# Altium schematic sheet NB2_DBCON.SchDoc: 3-Way Daughter-Board Socket
size A3; Organization: Altium Limited.; Address1: Level 3, 12a Rodborough Rd; Address2: Frenchs Forest 2086; Address3: NSW; Address4: AUSTRALIA; SheetNumber: 1; SheetTotal: 100; PageSetup: Record=PageOptions|CenterHorizontal=True|CenterVertical=True|PrintScale=0.75|XCorrection=1.00|YCorrection=1.00|PrintKind=0|BorderSize=5000000|LeftOffset=0|BottomOffset=0|Orientation=2|PaperLength=1000|PaperWidth=1000|Scale=100|PaperSource=7|PrintQuality=600|MediaType=1|DitherType=10|PaperKind=A4 (210 x 297mm)|PrintScaleMode=1
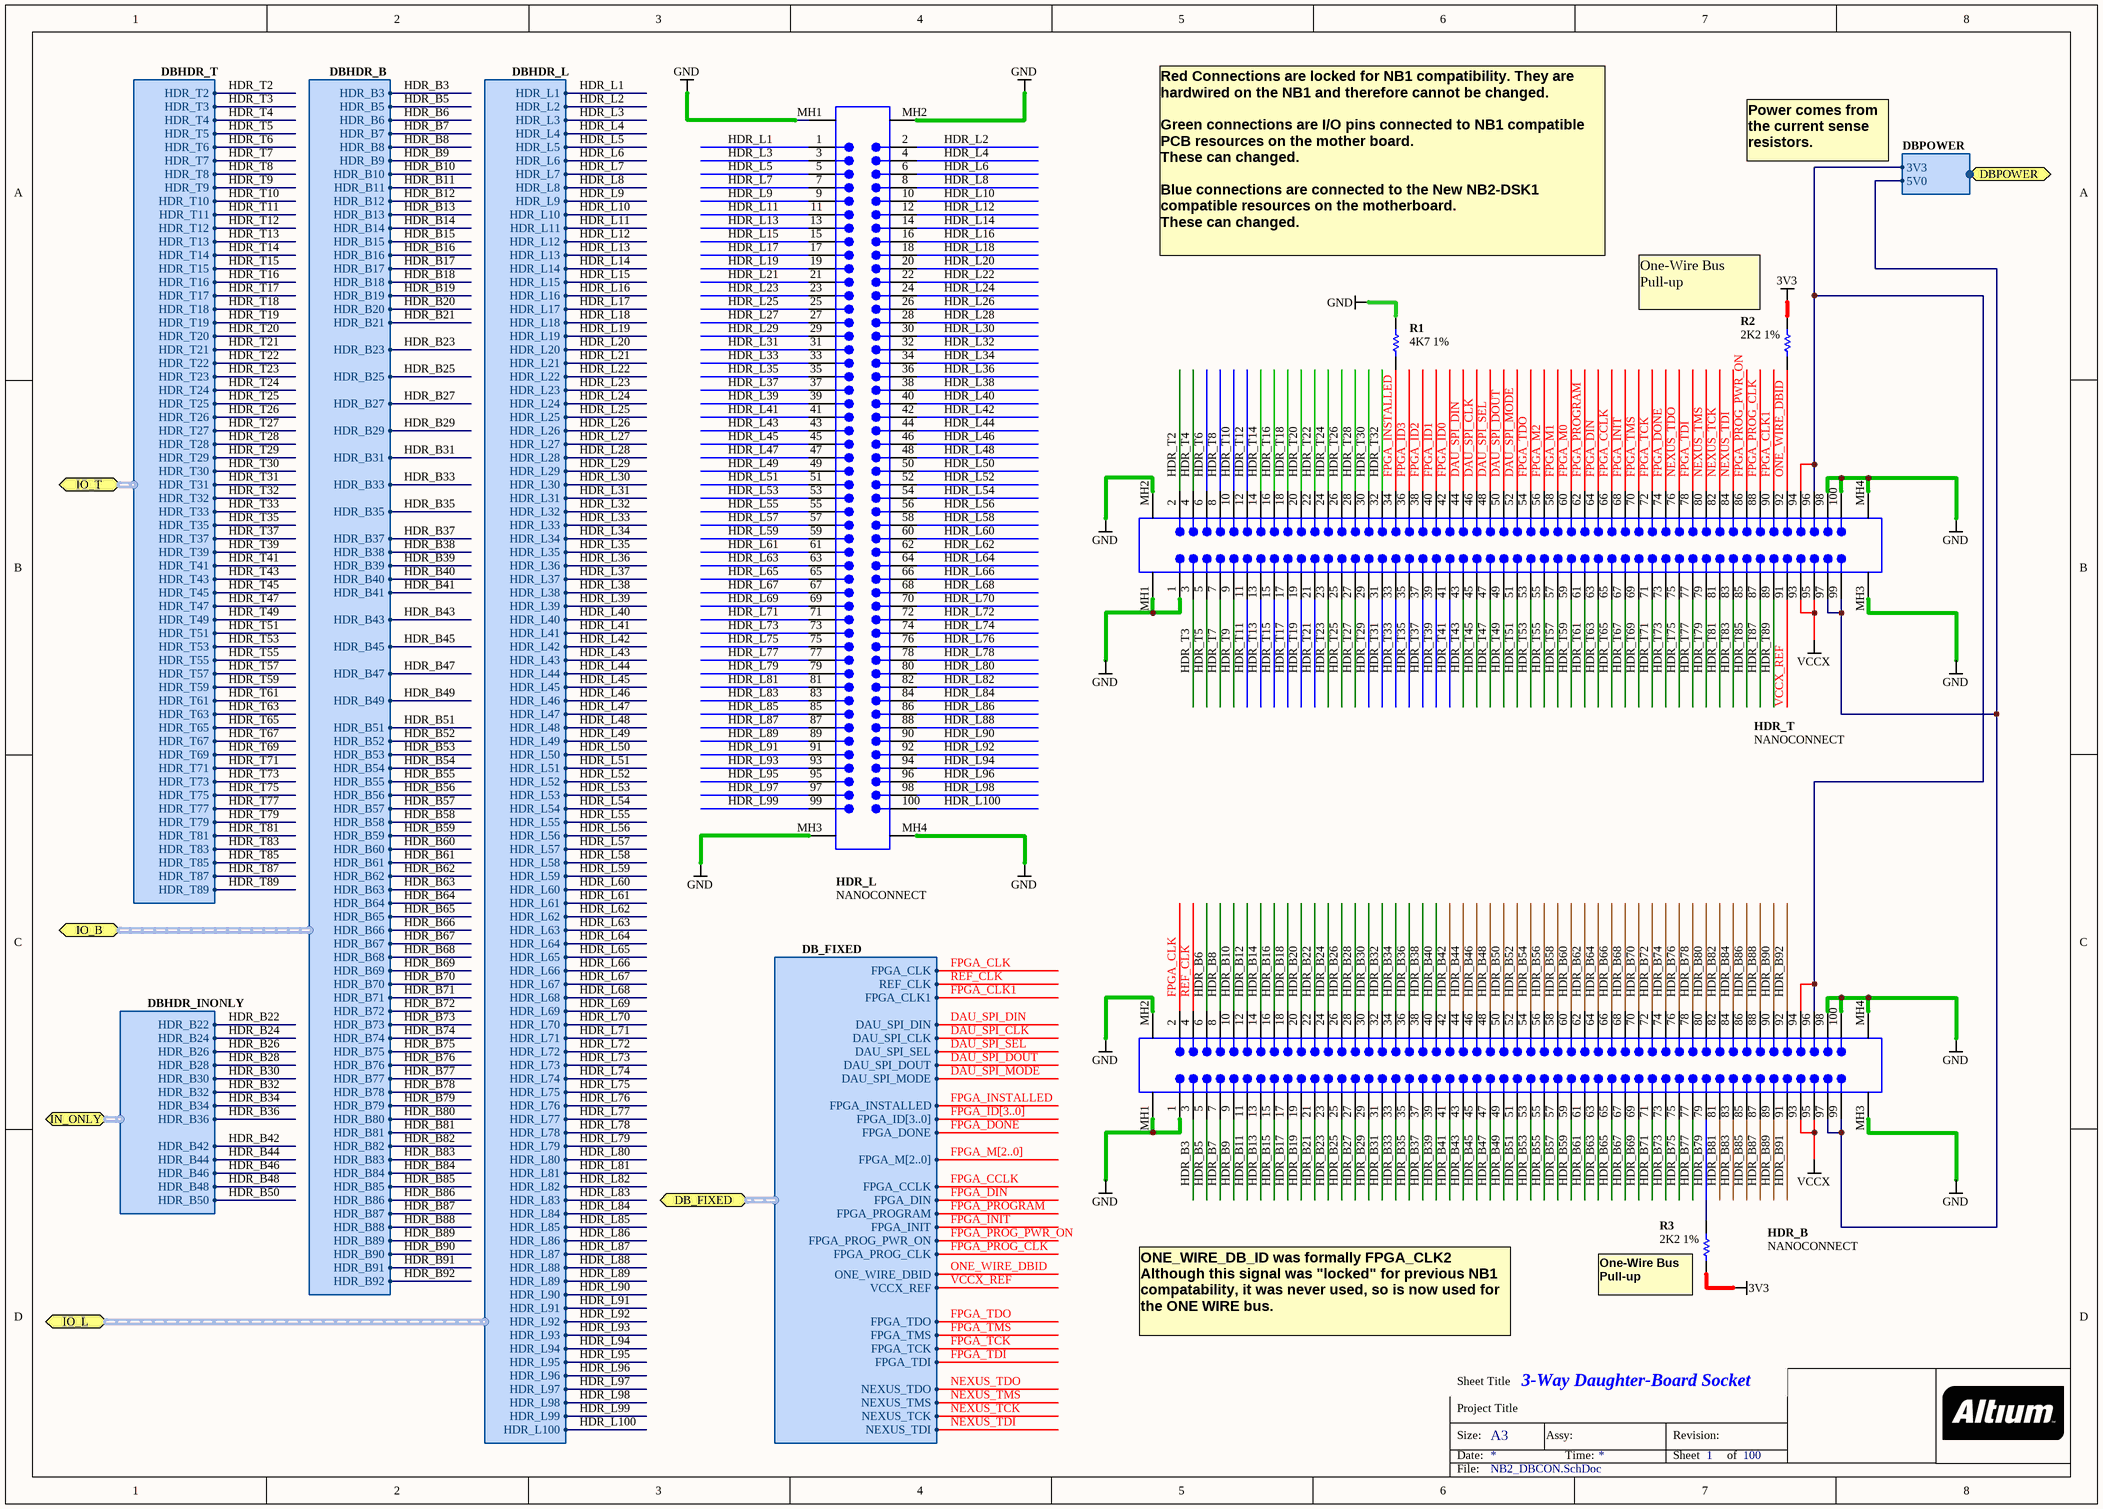
[diagram p0: NB2_DBCON.SchDoc]

## Parts
HDR_B  NANOCONNECT  [53751]
HDR_L  NANOCONNECT  [53751]
HDR_T  NANOCONNECT  [53751]
R1  4K7 1%  [RESC1005-STAR]
R2  2K2 1%  [RESC1005-STAR]
R3  2K2 1%  [RESC1005-STAR]

## Ports
DB_FIXED (harness DB_FIXED), DBPOWER (harness DBPOWER), IN_ONLY (harness DBHDR_INONLY), IO_B (harness DBHDR_B), IO_L (harness DBHDR_L), IO_T (harness DBHDR_T)

## Harnesses
DBPOWER: 3V3, 5V0
DB_FIXED: DAU_SPI_CLK, DAU_SPI_DIN, DAU_SPI_DOUT, NEXUS_TMS, NEXUS_TDI, NEXUS_TDO, NEXUS_TCK, ONE_WIRE_DBID, FPGA_INSTALLED, FPGA_PROG_CLK, DAU_SPI_SEL, DAU_SPI_MODE, FPGA_PROG_PWR_ON, FPGA_DONE, FPGA_CCLK, FPGA_PROGRAM, FPGA_DIN, FPGA_INIT, FPGA_TDO, FPGA_TDI, FPGA_TCK, FPGA_TMS, FPGA_CLK1, FPGA_ID[3..0], FPGA_M[2..0], VCCX_REF, FPGA_CLK, REF_CLK
DBHDR_B: HDR_B3, HDR_B5, HDR_B6, HDR_B7, HDR_B8, HDR_B9, HDR_B10, HDR_B11, HDR_B12, HDR_B13, HDR_B14, HDR_B15, HDR_B16, HDR_B17, HDR_B18, HDR_B19, HDR_B20, HDR_B21, HDR_B23, HDR_B25, HDR_B27, HDR_B29, HDR_B31, HDR_B33, HDR_B35, HDR_B37, HDR_B38, HDR_B39, HDR_B40, HDR_B41, HDR_B43, HDR_B45, HDR_B47, HDR_B49, HDR_B51, HDR_B52, HDR_B53, HDR_B54, HDR_B55, HDR_B56, HDR_B57, HDR_B58, HDR_B59, HDR_B60, HDR_B61, HDR_B62, HDR_B63, HDR_B64, HDR_B65, HDR_B66, HDR_B67, HDR_B68, HDR_B69, HDR_B70, HDR_B71, HDR_B72, HDR_B73, HDR_B74, HDR_B75, HDR_B76, HDR_B77, HDR_B78, HDR_B79, HDR_B80, HDR_B81, HDR_B82, HDR_B83, HDR_B84, HDR_B85, HDR_B86, HDR_B87, HDR_B88, HDR_B89, HDR_B90, HDR_B91, HDR_B92
DBHDR_T: HDR_T2, HDR_T3, HDR_T4, HDR_T5, HDR_T6, HDR_T7, HDR_T8, HDR_T9, HDR_T10, HDR_T11, HDR_T12, HDR_T13, HDR_T14, HDR_T15, HDR_T16, HDR_T17, HDR_T18, HDR_T19, HDR_T20, HDR_T21, HDR_T22, HDR_T23, HDR_T24, HDR_T25, HDR_T26, HDR_T27, HDR_T28, HDR_T29, HDR_T30, HDR_T31, HDR_T32, HDR_T33, HDR_T35, HDR_T37, HDR_T39, HDR_T41, HDR_T43, HDR_T45, HDR_T47, HDR_T49, HDR_T51, HDR_T53, HDR_T55, HDR_T57, HDR_T59, HDR_T61, HDR_T63, HDR_T65, HDR_T67, HDR_T69, HDR_T71, HDR_T73, HDR_T75, HDR_T77, HDR_T79, HDR_T81, HDR_T83, HDR_T85, HDR_T87, HDR_T89
DBHDR_L: HDR_L1, HDR_L2, HDR_L3, HDR_L4, HDR_L5, HDR_L6, HDR_L7, HDR_L8, HDR_L9, HDR_L10, HDR_L11, HDR_L12, HDR_L13, HDR_L14, HDR_L15, HDR_L16, HDR_L17, HDR_L18, HDR_L19, HDR_L20, HDR_L21, HDR_L22, HDR_L23, HDR_L24, HDR_L25, HDR_L26, HDR_L27, HDR_L28, HDR_L29, HDR_L30, HDR_L31, HDR_L32, HDR_L33, HDR_L34, HDR_L35, HDR_L36, HDR_L37, HDR_L38, HDR_L39, HDR_L40, HDR_L41, HDR_L42, HDR_L43, HDR_L44, HDR_L45, HDR_L46, HDR_L47, HDR_L48, HDR_L49, HDR_L50, HDR_L51, HDR_L52, HDR_L53, HDR_L54, HDR_L55, HDR_L56, HDR_L57, HDR_L58, HDR_L59, HDR_L60, HDR_L61, HDR_L62, HDR_L63, HDR_L64, HDR_L65, HDR_L66, HDR_L67, HDR_L68, HDR_L69, HDR_L70, HDR_L71, HDR_L72, HDR_L73, HDR_L74, HDR_L75, HDR_L76, HDR_L77, HDR_L78, HDR_L79, HDR_L80, HDR_L81, HDR_L82, HDR_L83, HDR_L84, HDR_L85, HDR_L86, HDR_L87, HDR_L88, HDR_L89, HDR_L90, HDR_L91, HDR_L92, HDR_L93, HDR_L94, HDR_L95, HDR_L96, HDR_L97, HDR_L98, HDR_L99, HDR_L100
DBHDR_INONLY: HDR_B22, HDR_B24, HDR_B26, HDR_B28, HDR_B30, HDR_B32, HDR_B34, HDR_B36, HDR_B42, HDR_B44, HDR_B46, HDR_B48, HDR_B50

## Nets
3V3: R2.2 R3.1
GND: HDR_B.1 HDR_B.98 HDR_B.100 HDR_B.MH1 HDR_B.MH2 HDR_B.MH3 HDR_B.MH4 HDR_L.MH1 HDR_L.MH2 HDR_L.MH3 HDR_L.MH4 HDR_T.1 HDR_T.98 HDR_T.100 HDR_T.MH1 HDR_T.MH2 HDR_T.MH3 HDR_T.MH4 R1.2
VCCX: HDR_B.93 HDR_B.95 HDR_T.93 HDR_T.95
DAU_SPI_CLK: HDR_T.46 ; port DB_FIXED.DAU_SPI_CLK
DAU_SPI_DIN: HDR_T.44 ; port DB_FIXED.DAU_SPI_DIN
DAU_SPI_DOUT: HDR_T.50 ; port DB_FIXED.DAU_SPI_DOUT
DAU_SPI_MODE: HDR_T.52 ; port DB_FIXED.DAU_SPI_MODE
DAU_SPI_SEL: HDR_T.48 ; port DB_FIXED.DAU_SPI_SEL
FPGA_CCLK: HDR_T.66 ; port DB_FIXED.FPGA_CCLK
FPGA_CLK: HDR_B.2 ; port DB_FIXED.FPGA_CLK
FPGA_CLK1: HDR_T.90 ; port DB_FIXED.FPGA_CLK1
FPGA_DIN: HDR_T.64 ; port DB_FIXED.FPGA_DIN
FPGA_DONE: HDR_T.74 ; port DB_FIXED.FPGA_DONE
FPGA_ID0: HDR_T.42
FPGA_ID1: HDR_T.40
FPGA_ID2: HDR_T.38
FPGA_ID3: HDR_T.36
FPGA_INIT: HDR_T.68 ; port DB_FIXED.FPGA_INIT
FPGA_INSTALLED: HDR_T.34 R1.1 ; port DB_FIXED.FPGA_INSTALLED
FPGA_M0: HDR_T.60
FPGA_M1: HDR_T.58
FPGA_M2: HDR_T.56
FPGA_PROG_CLK: HDR_T.88 ; port DB_FIXED.FPGA_PROG_CLK
FPGA_PROG_PWR_ON: HDR_T.86 ; port DB_FIXED.FPGA_PROG_PWR_ON
FPGA_PROGRAM: HDR_T.62 ; port DB_FIXED.FPGA_PROGRAM
FPGA_TCK: HDR_T.72 ; port DB_FIXED.FPGA_TCK
FPGA_TDI: HDR_T.78 ; port DB_FIXED.FPGA_TDI
FPGA_TDO: HDR_T.54 ; port DB_FIXED.FPGA_TDO
FPGA_TMS: HDR_T.70 ; port DB_FIXED.FPGA_TMS
HDR_B3: HDR_B.3 ; port IO_B.HDR_B3
HDR_B5: HDR_B.5 ; port IO_B.HDR_B5
HDR_B6: HDR_B.6 ; port IO_B.HDR_B6
HDR_B7: HDR_B.7 ; port IO_B.HDR_B7
HDR_B8: HDR_B.8 ; port IO_B.HDR_B8
HDR_B9: HDR_B.9 ; port IO_B.HDR_B9
HDR_B10: HDR_B.10 ; port IO_B.HDR_B10
HDR_B11: HDR_B.11 ; port IO_B.HDR_B11
HDR_B12: HDR_B.12 ; port IO_B.HDR_B12
HDR_B13: HDR_B.13 ; port IO_B.HDR_B13
HDR_B14: HDR_B.14 ; port IO_B.HDR_B14
HDR_B15: HDR_B.15 ; port IO_B.HDR_B15
HDR_B16: HDR_B.16 ; port IO_B.HDR_B16
HDR_B17: HDR_B.17 ; port IO_B.HDR_B17
HDR_B18: HDR_B.18 ; port IO_B.HDR_B18
HDR_B19: HDR_B.19 ; port IO_B.HDR_B19
HDR_B20: HDR_B.20 ; port IO_B.HDR_B20
HDR_B21: HDR_B.21 ; port IO_B.HDR_B21
HDR_B22: HDR_B.22 ; port IN_ONLY.HDR_B22
HDR_B23: HDR_B.23 ; port IO_B.HDR_B23
HDR_B24: HDR_B.24 ; port IN_ONLY.HDR_B24
HDR_B25: HDR_B.25 ; port IO_B.HDR_B25
HDR_B26: HDR_B.26 ; port IN_ONLY.HDR_B26
HDR_B27: HDR_B.27 ; port IO_B.HDR_B27
HDR_B28: HDR_B.28 ; port IN_ONLY.HDR_B28
HDR_B29: HDR_B.29 ; port IO_B.HDR_B29
HDR_B30: HDR_B.30 ; port IN_ONLY.HDR_B30
HDR_B31: HDR_B.31 ; port IO_B.HDR_B31
HDR_B32: HDR_B.32 ; port IN_ONLY.HDR_B32
HDR_B33: HDR_B.33 ; port IO_B.HDR_B33
HDR_B34: HDR_B.34 ; port IN_ONLY.HDR_B34
HDR_B35: HDR_B.35 ; port IO_B.HDR_B35
HDR_B36: HDR_B.36 ; port IN_ONLY.HDR_B36
HDR_B37: HDR_B.37 ; port IO_B.HDR_B37
HDR_B38: HDR_B.38 ; port IO_B.HDR_B38
HDR_B39: HDR_B.39 ; port IO_B.HDR_B39
HDR_B40: HDR_B.40 ; port IO_B.HDR_B40
HDR_B41: HDR_B.41 ; port IO_B.HDR_B41
HDR_B42: HDR_B.42 ; port IN_ONLY.HDR_B42
HDR_B43: HDR_B.43 ; port IO_B.HDR_B43
HDR_B44: HDR_B.44 ; port IN_ONLY.HDR_B44
HDR_B45: HDR_B.45 ; port IO_B.HDR_B45
HDR_B46: HDR_B.46 ; port IN_ONLY.HDR_B46
HDR_B47: HDR_B.47 ; port IO_B.HDR_B47
HDR_B48: HDR_B.48 ; port IN_ONLY.HDR_B48
HDR_B49: HDR_B.49 ; port IO_B.HDR_B49
HDR_B50: HDR_B.50 ; port IN_ONLY.HDR_B50
HDR_B51: HDR_B.51 ; port IO_B.HDR_B51
HDR_B52: HDR_B.52 ; port IO_B.HDR_B52
HDR_B53: HDR_B.53 ; port IO_B.HDR_B53
HDR_B54: HDR_B.54 ; port IO_B.HDR_B54
HDR_B55: HDR_B.55 ; port IO_B.HDR_B55
HDR_B56: HDR_B.56 ; port IO_B.HDR_B56
HDR_B57: HDR_B.57 ; port IO_B.HDR_B57
HDR_B58: HDR_B.58 ; port IO_B.HDR_B58
HDR_B59: HDR_B.59 ; port IO_B.HDR_B59
HDR_B60: HDR_B.60 ; port IO_B.HDR_B60
HDR_B61: HDR_B.61 ; port IO_B.HDR_B61
HDR_B62: HDR_B.62 ; port IO_B.HDR_B62
HDR_B63: HDR_B.63 ; port IO_B.HDR_B63
HDR_B64: HDR_B.64 ; port IO_B.HDR_B64
HDR_B65: HDR_B.65 ; port IO_B.HDR_B65
HDR_B66: HDR_B.66 ; port IO_B.HDR_B66
HDR_B67: HDR_B.67 ; port IO_B.HDR_B67
HDR_B68: HDR_B.68 ; port IO_B.HDR_B68
HDR_B69: HDR_B.69 ; port IO_B.HDR_B69
HDR_B70: HDR_B.70 ; port IO_B.HDR_B70
HDR_B71: HDR_B.71 ; port IO_B.HDR_B71
HDR_B72: HDR_B.72 ; port IO_B.HDR_B72
HDR_B73: HDR_B.73 ; port IO_B.HDR_B73
HDR_B74: HDR_B.74 ; port IO_B.HDR_B74
HDR_B75: HDR_B.75 ; port IO_B.HDR_B75
HDR_B76: HDR_B.76 ; port IO_B.HDR_B76
HDR_B77: HDR_B.77 ; port IO_B.HDR_B77
HDR_B78: HDR_B.78 ; port IO_B.HDR_B78
HDR_B79: HDR_B.79 R3.2 ; port IO_B.HDR_B79
HDR_B80: HDR_B.80 ; port IO_B.HDR_B80
HDR_B81: HDR_B.81 ; port IO_B.HDR_B81
HDR_B82: HDR_B.82 ; port IO_B.HDR_B82
HDR_B83: HDR_B.83 ; port IO_B.HDR_B83
HDR_B84: HDR_B.84 ; port IO_B.HDR_B84
HDR_B85: HDR_B.85 ; port IO_B.HDR_B85
HDR_B86: HDR_B.86 ; port IO_B.HDR_B86
HDR_B87: HDR_B.87 ; port IO_B.HDR_B87
HDR_B88: HDR_B.88 ; port IO_B.HDR_B88
HDR_B89: HDR_B.89 ; port IO_B.HDR_B89
HDR_B90: HDR_B.90 ; port IO_B.HDR_B90
HDR_B91: HDR_B.91 ; port IO_B.HDR_B91
HDR_B92: HDR_B.92 ; port IO_B.HDR_B92
HDR_L1: HDR_L.1 ; port IO_L.HDR_L1
HDR_L2: HDR_L.2 ; port IO_L.HDR_L2
HDR_L3: HDR_L.3 ; port IO_L.HDR_L3
HDR_L4: HDR_L.4 ; port IO_L.HDR_L4
HDR_L5: HDR_L.5 ; port IO_L.HDR_L5
HDR_L6: HDR_L.6 ; port IO_L.HDR_L6
HDR_L7: HDR_L.7 ; port IO_L.HDR_L7
HDR_L8: HDR_L.8 ; port IO_L.HDR_L8
HDR_L9: HDR_L.9 ; port IO_L.HDR_L9
HDR_L10: HDR_L.10 ; port IO_L.HDR_L10
HDR_L11: HDR_L.11 ; port IO_L.HDR_L11
HDR_L12: HDR_L.12 ; port IO_L.HDR_L12
HDR_L13: HDR_L.13 ; port IO_L.HDR_L13
HDR_L14: HDR_L.14 ; port IO_L.HDR_L14
HDR_L15: HDR_L.15 ; port IO_L.HDR_L15
HDR_L16: HDR_L.16 ; port IO_L.HDR_L16
HDR_L17: HDR_L.17 ; port IO_L.HDR_L17
HDR_L18: HDR_L.18 ; port IO_L.HDR_L18
HDR_L19: HDR_L.19 ; port IO_L.HDR_L19
HDR_L20: HDR_L.20 ; port IO_L.HDR_L20
HDR_L21: HDR_L.21 ; port IO_L.HDR_L21
HDR_L22: HDR_L.22 ; port IO_L.HDR_L22
HDR_L23: HDR_L.23 ; port IO_L.HDR_L23
HDR_L24: HDR_L.24 ; port IO_L.HDR_L24
HDR_L25: HDR_L.25 ; port IO_L.HDR_L25
HDR_L26: HDR_L.26 ; port IO_L.HDR_L26
HDR_L27: HDR_L.27 ; port IO_L.HDR_L27
HDR_L28: HDR_L.28 ; port IO_L.HDR_L28
HDR_L29: HDR_L.29 ; port IO_L.HDR_L29
HDR_L30: HDR_L.30 ; port IO_L.HDR_L30
HDR_L31: HDR_L.31 ; port IO_L.HDR_L31
HDR_L32: HDR_L.32 ; port IO_L.HDR_L32
HDR_L33: HDR_L.33 ; port IO_L.HDR_L33
HDR_L34: HDR_L.34 ; port IO_L.HDR_L34
HDR_L35: HDR_L.35 ; port IO_L.HDR_L35
HDR_L36: HDR_L.36 ; port IO_L.HDR_L36
HDR_L37: HDR_L.37 ; port IO_L.HDR_L37
HDR_L38: HDR_L.38 ; port IO_L.HDR_L38
HDR_L39: HDR_L.39 ; port IO_L.HDR_L39
HDR_L40: HDR_L.40 ; port IO_L.HDR_L40
HDR_L41: HDR_L.41 ; port IO_L.HDR_L41
HDR_L42: HDR_L.42 ; port IO_L.HDR_L42
HDR_L43: HDR_L.43 ; port IO_L.HDR_L43
HDR_L44: HDR_L.44 ; port IO_L.HDR_L44
HDR_L45: HDR_L.45 ; port IO_L.HDR_L45
HDR_L46: HDR_L.46 ; port IO_L.HDR_L46
HDR_L47: HDR_L.47 ; port IO_L.HDR_L47
HDR_L48: HDR_L.48 ; port IO_L.HDR_L48
HDR_L49: HDR_L.49 ; port IO_L.HDR_L49
HDR_L50: HDR_L.50 ; port IO_L.HDR_L50
HDR_L51: HDR_L.51 ; port IO_L.HDR_L51
HDR_L52: HDR_L.52 ; port IO_L.HDR_L52
HDR_L53: HDR_L.53 ; port IO_L.HDR_L53
HDR_L54: HDR_L.54 ; port IO_L.HDR_L54
HDR_L55: HDR_L.55 ; port IO_L.HDR_L55
HDR_L56: HDR_L.56 ; port IO_L.HDR_L56
HDR_L57: HDR_L.57 ; port IO_L.HDR_L57
HDR_L58: HDR_L.58 ; port IO_L.HDR_L58
HDR_L59: HDR_L.59 ; port IO_L.HDR_L59
HDR_L60: HDR_L.60 ; port IO_L.HDR_L60
HDR_L61: HDR_L.61 ; port IO_L.HDR_L61
HDR_L62: HDR_L.62 ; port IO_L.HDR_L62
HDR_L63: HDR_L.63 ; port IO_L.HDR_L63
HDR_L64: HDR_L.64 ; port IO_L.HDR_L64
HDR_L65: HDR_L.65 ; port IO_L.HDR_L65
HDR_L66: HDR_L.66 ; port IO_L.HDR_L66
HDR_L67: HDR_L.67 ; port IO_L.HDR_L67
HDR_L68: HDR_L.68 ; port IO_L.HDR_L68
HDR_L69: HDR_L.69 ; port IO_L.HDR_L69
HDR_L70: HDR_L.70 ; port IO_L.HDR_L70
HDR_L71: HDR_L.71 ; port IO_L.HDR_L71
HDR_L72: HDR_L.72 ; port IO_L.HDR_L72
HDR_L73: HDR_L.73 ; port IO_L.HDR_L73
HDR_L74: HDR_L.74 ; port IO_L.HDR_L74
HDR_L75: HDR_L.75 ; port IO_L.HDR_L75
HDR_L76: HDR_L.76 ; port IO_L.HDR_L76
HDR_L77: HDR_L.77 ; port IO_L.HDR_L77
HDR_L78: HDR_L.78 ; port IO_L.HDR_L78
HDR_L79: HDR_L.79 ; port IO_L.HDR_L79
HDR_L80: HDR_L.80 ; port IO_L.HDR_L80
HDR_L81: HDR_L.81 ; port IO_L.HDR_L81
HDR_L82: HDR_L.82 ; port IO_L.HDR_L82
HDR_L83: HDR_L.83 ; port IO_L.HDR_L83
HDR_L84: HDR_L.84 ; port IO_L.HDR_L84
HDR_L85: HDR_L.85 ; port IO_L.HDR_L85
HDR_L86: HDR_L.86 ; port IO_L.HDR_L86
HDR_L87: HDR_L.87 ; port IO_L.HDR_L87
HDR_L88: HDR_L.88 ; port IO_L.HDR_L88
HDR_L89: HDR_L.89 ; port IO_L.HDR_L89
HDR_L90: HDR_L.90 ; port IO_L.HDR_L90
HDR_L91: HDR_L.91 ; port IO_L.HDR_L91
HDR_L92: HDR_L.92 ; port IO_L.HDR_L92
HDR_L93: HDR_L.93 ; port IO_L.HDR_L93
HDR_L94: HDR_L.94 ; port IO_L.HDR_L94
HDR_L95: HDR_L.95 ; port IO_L.HDR_L95
HDR_L96: HDR_L.96 ; port IO_L.HDR_L96
HDR_L97: HDR_L.97 ; port IO_L.HDR_L97
HDR_L98: HDR_L.98 ; port IO_L.HDR_L98
HDR_L99: HDR_L.99 ; port IO_L.HDR_L99
HDR_L100: HDR_L.100 ; port IO_L.HDR_L100
HDR_T2: HDR_T.2 ; port IO_T.HDR_T2
HDR_T3: HDR_T.3 ; port IO_T.HDR_T3
HDR_T4: HDR_T.4 ; port IO_T.HDR_T4
HDR_T5: HDR_T.5 ; port IO_T.HDR_T5
HDR_T6: HDR_T.6 ; port IO_T.HDR_T6
HDR_T7: HDR_T.7 ; port IO_T.HDR_T7
HDR_T8: HDR_T.8 ; port IO_T.HDR_T8
HDR_T9: HDR_T.9 ; port IO_T.HDR_T9
HDR_T10: HDR_T.10 ; port IO_T.HDR_T10
HDR_T11: HDR_T.11 ; port IO_T.HDR_T11
HDR_T12: HDR_T.12 ; port IO_T.HDR_T12
HDR_T13: HDR_T.13 ; port IO_T.HDR_T13
HDR_T14: HDR_T.14 ; port IO_T.HDR_T14
HDR_T15: HDR_T.15 ; port IO_T.HDR_T15
HDR_T16: HDR_T.16 ; port IO_T.HDR_T16
HDR_T17: HDR_T.17 ; port IO_T.HDR_T17
HDR_T18: HDR_T.18 ; port IO_T.HDR_T18
HDR_T19: HDR_T.19 ; port IO_T.HDR_T19
HDR_T20: HDR_T.20 ; port IO_T.HDR_T20
HDR_T21: HDR_T.21 ; port IO_T.HDR_T21
HDR_T22: HDR_T.22 ; port IO_T.HDR_T22
HDR_T23: HDR_T.23 ; port IO_T.HDR_T23
HDR_T24: HDR_T.24 ; port IO_T.HDR_T24
HDR_T25: HDR_T.25 ; port IO_T.HDR_T25
HDR_T26: HDR_T.26 ; port IO_T.HDR_T26
HDR_T27: HDR_T.27 ; port IO_T.HDR_T27
HDR_T28: HDR_T.28 ; port IO_T.HDR_T28
HDR_T29: HDR_T.29 ; port IO_T.HDR_T29
HDR_T30: HDR_T.30 ; port IO_T.HDR_T30
HDR_T31: HDR_T.31 ; port IO_T.HDR_T31
HDR_T32: HDR_T.32 ; port IO_T.HDR_T32
HDR_T33: HDR_T.33 ; port IO_T.HDR_T33
HDR_T35: HDR_T.35 ; port IO_T.HDR_T35
HDR_T37: HDR_T.37 ; port IO_T.HDR_T37
HDR_T39: HDR_T.39 ; port IO_T.HDR_T39
HDR_T41: HDR_T.41 ; port IO_T.HDR_T41
HDR_T43: HDR_T.43 ; port IO_T.HDR_T43
HDR_T45: HDR_T.45 ; port IO_T.HDR_T45
HDR_T47: HDR_T.47 ; port IO_T.HDR_T47
HDR_T49: HDR_T.49 ; port IO_T.HDR_T49
HDR_T51: HDR_T.51 ; port IO_T.HDR_T51
HDR_T53: HDR_T.53 ; port IO_T.HDR_T53
HDR_T55: HDR_T.55 ; port IO_T.HDR_T55
HDR_T57: HDR_T.57 ; port IO_T.HDR_T57
HDR_T59: HDR_T.59 ; port IO_T.HDR_T59
HDR_T61: HDR_T.61 ; port IO_T.HDR_T61
HDR_T63: HDR_T.63 ; port IO_T.HDR_T63
HDR_T65: HDR_T.65 ; port IO_T.HDR_T65
HDR_T67: HDR_T.67 ; port IO_T.HDR_T67
HDR_T69: HDR_T.69 ; port IO_T.HDR_T69
HDR_T71: HDR_T.71 ; port IO_T.HDR_T71
HDR_T73: HDR_T.73 ; port IO_T.HDR_T73
HDR_T75: HDR_T.75 ; port IO_T.HDR_T75
HDR_T77: HDR_T.77 ; port IO_T.HDR_T77
HDR_T79: HDR_T.79 ; port IO_T.HDR_T79
HDR_T81: HDR_T.81 ; port IO_T.HDR_T81
HDR_T83: HDR_T.83 ; port IO_T.HDR_T83
HDR_T85: HDR_T.85 ; port IO_T.HDR_T85
HDR_T87: HDR_T.87 ; port IO_T.HDR_T87
HDR_T89: HDR_T.89 ; port IO_T.HDR_T89
NEXUS_TCK: HDR_T.82 ; port DB_FIXED.NEXUS_TCK
NEXUS_TDI: HDR_T.84 ; port DB_FIXED.NEXUS_TDI
NEXUS_TDO: HDR_T.76 ; port DB_FIXED.NEXUS_TDO
NEXUS_TMS: HDR_T.80 ; port DB_FIXED.NEXUS_TMS
ONE_WIRE_DBID: HDR_T.92 R2.1 ; port DB_FIXED.ONE_WIRE_DBID
REF_CLK: HDR_B.4 ; port DB_FIXED.REF_CLK
VCCX_REF: HDR_T.91 ; port DB_FIXED.VCCX_REF
NetHDR_B_94: HDR_B.94 HDR_B.96 HDR_T.94 HDR_T.96 ; port DBPOWER.3V3
NetHDR_B_97: HDR_B.97 HDR_B.99 HDR_T.97 HDR_T.99 ; port DBPOWER.5V0

## Buses and harness runs
bus FPGA_ID[3..0]
bus FPGA_M[2..0]

## Notes on the sheet
- Power comes from the current sense resistors.
- Red Connections are locked for NB1 compatibility. They are hardwired on the NB1 and therefore cannot be changed.
  Green connections are I/O pins connected to NB1 compatible PCB resources on the mother board.
  These can changed.
  Blue connections are connected to the New NB2-DSK1 compatible resources on the motherboard.
  These can changed.
- (near R2) One-Wire Bus
  Pull-up
- (near R3) One-Wire Bus
  Pull-up
- ONE_WIRE_DB_ID was formally FPGA_CLK2
  Although this signal was "locked" for previous NB1 compatability, it was never used, so is now used for the ONE WIRE bus.
- Sheet Title
- Project Title
- Size:
- Date:
- A3
- Assy:
- Time:
- Revision:
- Sheet
- of
- File:

## Library data of the parts
HDR_B HDR_L HDR_T = D-300-0026: Connector, Molex Docking Station 100 Pin Female 53751; Connector type: MOLEX - 53751-1009; Category: Connector; Status: Production
R1 = D-100-0088: Resistor, 4K7 1% 0402 (1005); Power Rating: 63 mW; Resistance: 4.7 K; Category: Resistor; Mounting Technology: Surface Mount; Status: Production; Tolerance: 1 %
R2 R3 = D-100-0107: Resistor, 2K2 1% 0402 (1005); Power Rating: 63 mW; Resistance: 2.2 K; Category: Resistor; Mounting Technology: Surface Mount; Status: Production; Tolerance: 1 %